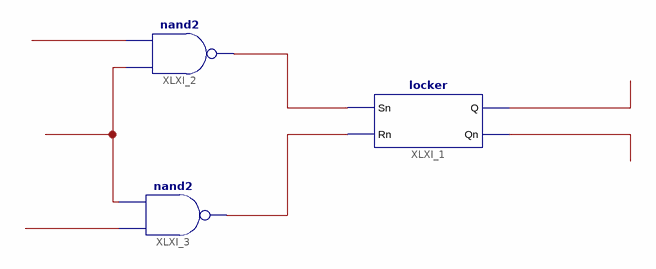
[diagram p0: schematic sheet 1]
// Xilinx ISE schematic RS_EN.sch (kintex7) as structural Verilog: 3 symbols, 0 ports
module RS_EN (
);

  wire XLXN_1, XLXN_2, XLXN_3, XLXN_4, XLXN_5, XLXN_6, XLXN_7;

  locker XLXI_1 (.Sn(XLXN_4), .Rn(XLXN_5), .Q(XLXN_6), .Qn(XLXN_7));
  nand XLXI_2 (XLXN_4, XLXN_2, XLXN_1);
  nand XLXI_3 (XLXN_5, XLXN_3, XLXN_2);
endmodule
